# EAGLE design T06_LockBox (EAGLE 7.1.0)
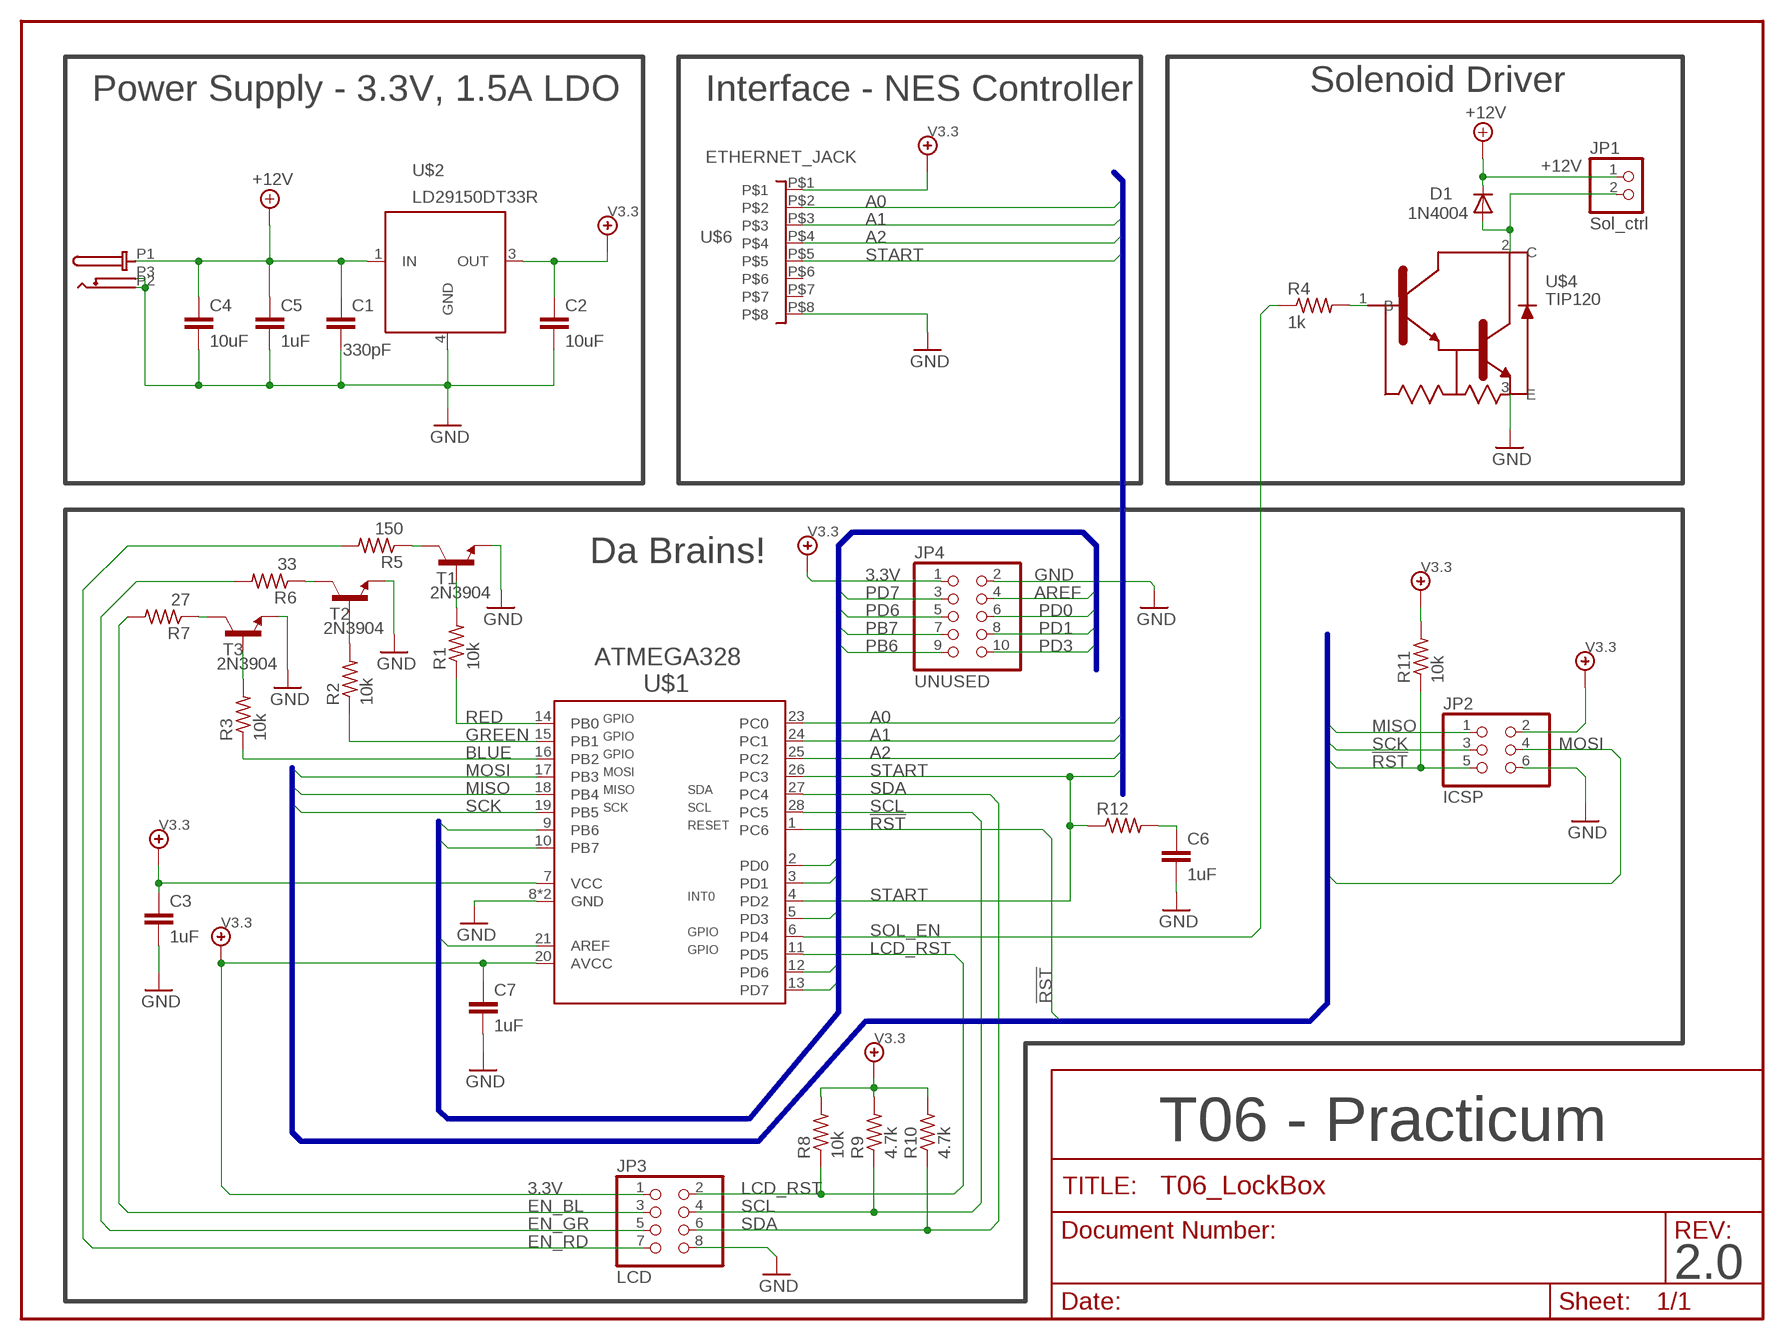
[diagram p0: schematic, sheet 1]

## Parts
C1  330pF  C  [C0805]
C2  10uF  C  [C0805]
C3  1uF  C  [C0805]
C4  10uF  CC1206  [C1206]
C5  1uF  C  [C0805]
C6  1uF  C  [C0805]
C7  1uF  C  [C0805]
D1  1N4004  [DO41-10]
JP1  Sol_ctrl  PINHD-1X2  [1X02]
JP2  ICSP  PINHD-2X3  [2X03]
JP3  LCD  PINHD-2X4  [2X04]
JP4  UNUSED  PINHD-2X5  [2X05]
R1  10k  R-US_R0805  [R0805]
R2  10k  R-US_R0805  [R0805]
R3  10k  R-US_R0805  [R0805]
R4  1k  R-US_M0805  [M0805]
R5  150  R-US_R0805  [R0805]
R6  33  R-US_R0805  [R0805]
R7  27  R-US_R0805  [R0805]
R8  10k  R-US_R0805  [R0805]
R9  4.7k  R-US_R0805  [R0805]
R10  4.7k  R-US_R0805  [R0805]
R11  10k  R-US_M0805  [M0805]
R12  R-US_M0805  [M0805]
T1  2N3904  [TO92-BCE]
T2  2N3904  [TO92-BCE]
T3  2N3904  [TO92-BCE]
U$1  ATMEGA328  [DIL28-3]
U$2  LD29150DT33R  [DPAK]
U$3  PJ-102A  [PJ-102A]
U$4  TIP120  [T0220-3]
U$6  ETHERNET_JACK  [MODJACK8]

## Nets
3.3V: C2.1 C3.1 C7.1 JP2.2 JP3.1 JP4.1 R8.2 R9.2 R10.2 R11.2 U$1.7(VCC) U$1.20(AVCC) U$2.3(OUT) U$6.P$1 ; supply symbol labelled V3.3
!RST: JP2.5 R11.1 U$1.1(PC6)
+12V: C1.1 C4.1 C5.1 D1.C JP1.1 U$2.1(IN) U$3.P1(PWR)
A0: U$1.23(PC0) U$6.P$2
A1: U$1.24(PC1) U$6.P$3
A2: U$1.25(PC2) U$6.P$4
AREF: JP4.4 U$1.21(AREF)
BLUE: R3.1 U$1.16(PB2)
EN_BL: JP3.3 R7.2
EN_GR: JP3.5 R6.2
EN_RD: JP3.7 R5.2
GND: C1.2 C2.2 C3.2 C4.2 C5.2 C6.2 C7.2 JP2.6 JP3.8 JP4.2 T1.E T2.E T3.E U$1.8(GND) U$1.22(GND) U$2.4(GND) U$3.P2(GND) U$3.P3(GND) U$4.3(E) U$6.P$8
GREEN: R2.1 U$1.15(PB1)
LCD_RST: JP3.2 R8.1 U$1.11(PD5)
MISO: JP2.1 U$1.18(PB4)
MOSI: JP2.4 U$1.17(PB3)
N$1: R4.2 U$4.1(B)
N$3: C6.1 R12.2
N$5: D1.A JP1.2 U$4.2(C)
N$6: R1.2 T1.B
N$7: R2.2 T2.B
N$8: R3.2 T3.B
N$10: R7.1 T3.C
N$11: R6.1 T2.C
N$12: R5.1 T1.C
PB6: JP4.9 U$1.9(PB6)
PB7: JP4.7 U$1.10(PB7)
PD0: JP4.6 U$1.2(PD0)
PD1: JP4.8 U$1.3(PD1)
PD3: JP4.10 U$1.5(PD3)
PD6: JP4.5 U$1.12(PD6)
PD7: JP4.3 U$1.13(PD7)
RED: R1.1 U$1.14(PB0)
SCK: JP2.3 U$1.19(PB5)
SCL: JP3.4 R9.1 U$1.28(PC5)
SDA: JP3.6 R10.1 U$1.27(PC4)
SOL_EN: R4.1 U$1.6(PD4)
START: R12.1 U$1.4(PD2) U$1.26(PC3) U$6.P$5
Unconnected: U$6.P$6 U$6.P$7

## Buses
NES_ENCODER_BUS:A0,A1,A2,START
ICSP_BUS:MISO,MOSI,!RST,SCK
UNUSED:AREF,PB6,PB7,PD0,PD1,PD3,PD6,PD7

## Notes on the sheet
- Power Supply - 3.3V, 1.5A LDO | Interface - NES Controller | Solenoid Driver
- Da Brains!
- T06 - Practicum
- 2.0

## Library data of the parts
C1-C7 = T06_Lockbox:C: CAPACITOR, European symbol; SPICEMODEL: NONE; SPICEPREFIX: C
D1 = T06_Lockbox:1N4004: DIODE general purpose rectifier, 1 A
JP1 = T06_Lockbox:PINHD-1X2: PIN HEADER
JP2 = T06_Lockbox:PINHD-2X3: PIN HEADER
JP3 = T06_Lockbox:PINHD-2X4: PIN HEADER
JP4 = T06_Lockbox:PINHD-2X5: PIN HEADER
R1-R12 = T06_Lockbox:R-US_: RESISTOR, American symbol
T1-T3 = T06_Lockbox:2N3904: NPN TRANSISTOR
U$1 = T06_Lockbox:ATMEGA328: Atmel 8-bit Microcontroller source: http://www.atmel.com/images/atmel-8271-8-bit-avr-microcontroller-atmega48a-48pa-88a-88pa-168a-168pa-328-328p_datasheet_summary.pdf; DIGIKEY: http://www.digikey.com/product-detail/en/ATMEGA328-PU/ATMEGA328-PU-ND/2271026; PB0: GPIO; PB1: GPIO; PB2: GPIO; PB3: MOSI; PB4: MISO; PB5: SCK; PC4: SDA; PC5: SCL; PC6: RESET; PD2: INT0; PD4: GPIO; PD5: GPIO
U$2 = T06_Lockbox:LD29150: LD29150 - 1.5A, Very low drop voltage regulator High current, high accuracey, low-dropout voltage regulator Source: http://www.st.com/web/en/resource/technical/document/datasheet/CD00003403.pdf; DIGIKEY: 497-3468-1-ND; VOUT: 3.3V
U$3 = T06_Lockbox:PJ-102A
U$4 = T06_Lockbox:TIP120: TIP120 - NPN Epitaxial Darlington Transistor Medium Power Linear Switch Source: https://www.fairchildsemi.com/datasheets/TI/TIP122.pdf; DIGIKEY: TIP120TUFS-ND; MFG: Fairchild
U$6 = T06_Lockbox:ETHERNET_JACK: 8-Pin eithernet jack

## Board
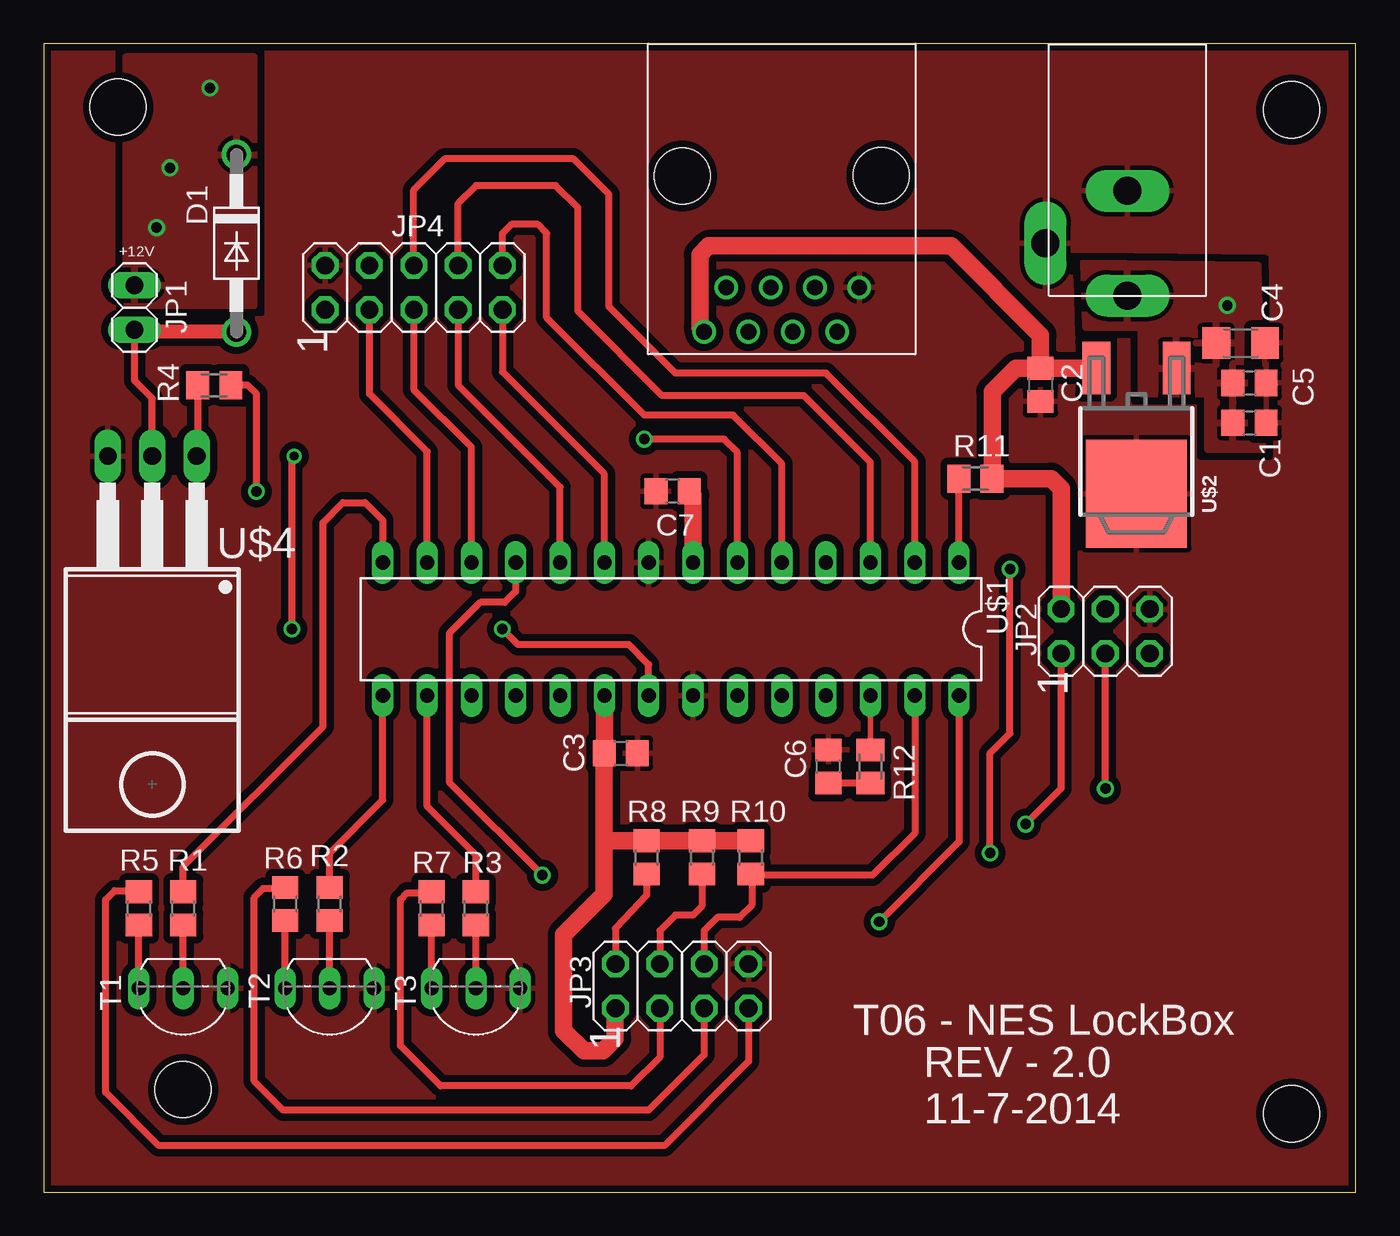
[diagram p1: board, top side]
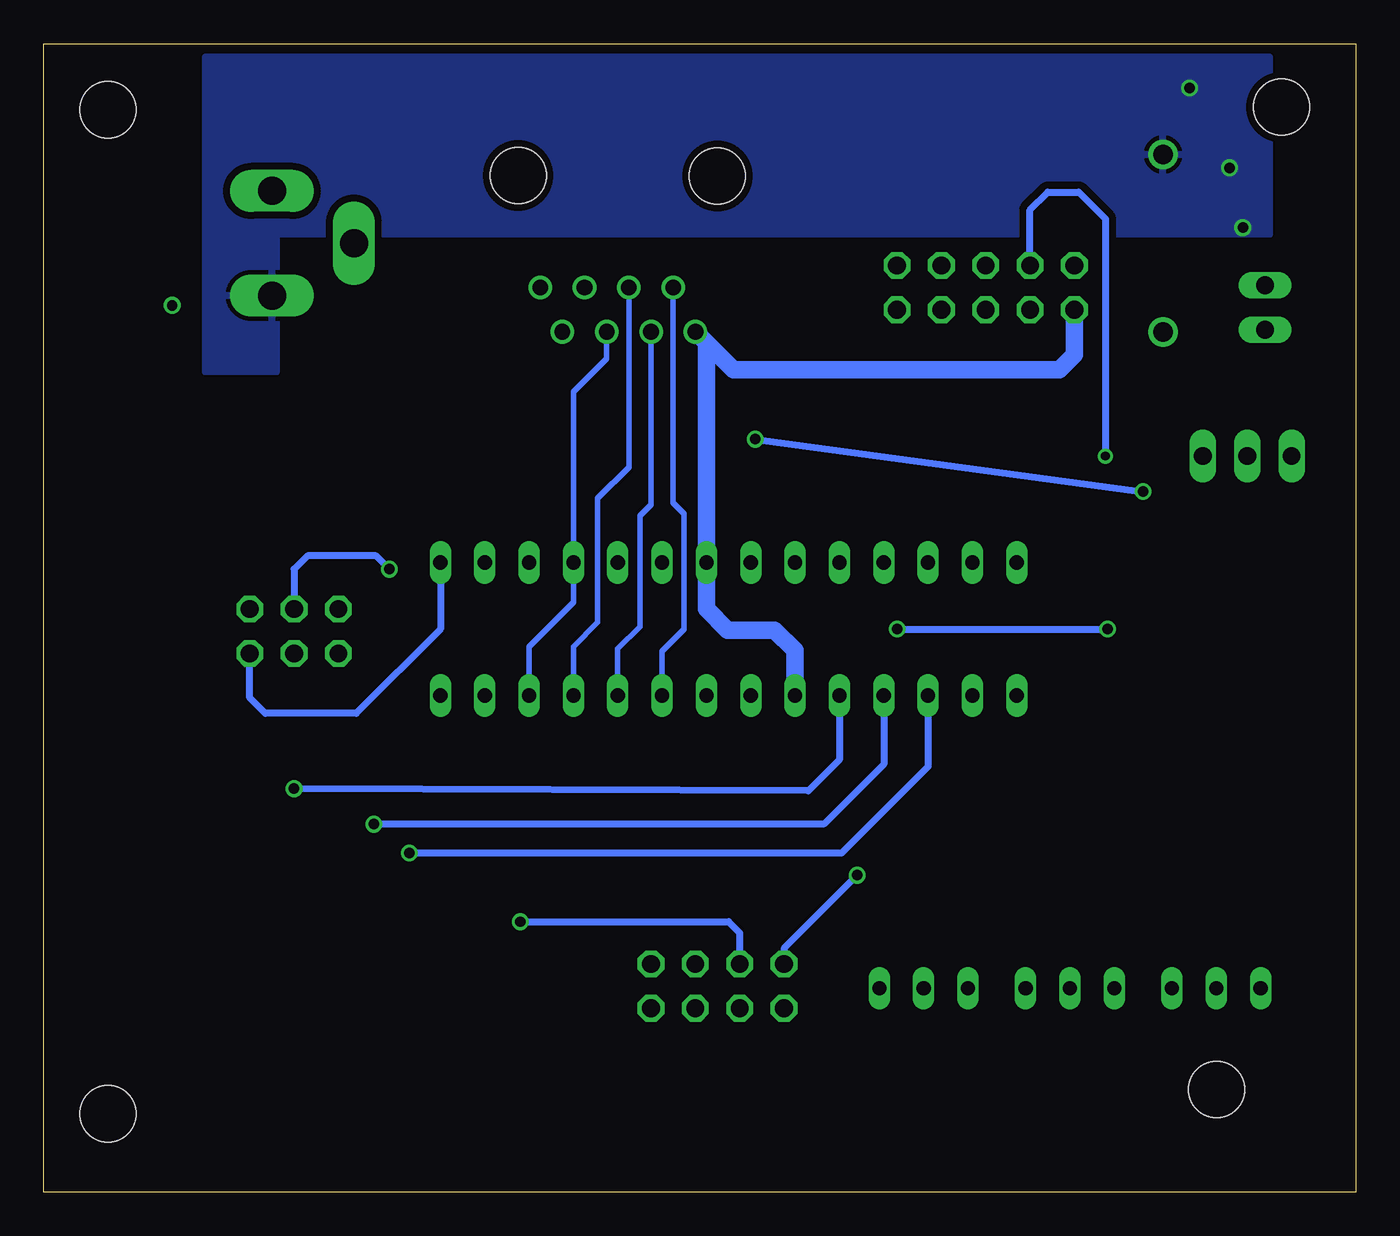
[diagram p2: board, bottom side, seen from below]

Size 75.18 x 65.79 mm. Coordinates in mm from the lower left corner, seen from the top.
Outline: 0,0 75.18,0 75.18,65.79 0,65.79 0,0
Copper layers (1*16): Top 0.0356mm / dielectric 1.5011mm / Bottom 0.0356mm
Design rules "oshpark-2layer": minimum track width 6mil, minimum drill 13mil, track to track 6mil, track to pad 6mil, pad to pad 6mil, via to via 6mil, smd to smd 6mil, copper to edge 15mil, drill to drill 6mil, minimum pad ring 7mil, minimum via ring 7mil, stop-mask expansion 4mil, vias tented up to drill 0mil, thermal gap 10mil
Holes 3.2 mm at 4.27,62.15 7.99,5.89 71.5,4.5 71.5,62

### Footprints (pad centres in the part's own frame; a part is rotated, then mirrored left to right if it is on the bottom)
C0805 = smd 1.3 x 1.5: 1 -0.95,0; 2 0.95,0
C1206 = smd 1.6 x 1.8: 1 -1.4,0; 2 1.4,0
DO41-10 = drill 1.118: A 5.08,0; C -5.08,0
1X02 = drill 1.016 long: 1 -1.27,0; 2 1.27,0
2X03 = drill 1.016 octagon: 1 -2.54,-1.27; 2 -2.54,1.27; 3 0,-1.27; 4 0,1.27; 5 2.54,-1.27; 6 2.54,1.27
2X04 = drill 1.016 octagon: 1 -3.81,-1.27; 2 -3.81,1.27; 3 -1.27,-1.27; 4 -1.27,1.27; 5 1.27,-1.27; 6 1.27,1.27; 7 3.81,-1.27; 8 3.81,1.27
2X05 = drill 1.016 octagon: 1 -5.08,-1.27; 2 -5.08,1.27; 3 -2.54,-1.27; 4 -2.54,1.27; 5 0,-1.27; 6 0,1.27; 7 2.54,-1.27; 8 2.54,1.27; 9 5.08,-1.27; 10 5.08,1.27
R0805 = smd 1.3 x 1.5: 1 -0.95,0; 2 0.95,0
M0805 = smd 1.3 x 1.6: 1 -0.95,0; 2 0.95,0
TO92-BCE = drill 0.813 long: B 0,0; C 2.54,0; E -2.54,0
DIL28-3 = drill 0.813 long: 1 -16.51,-3.81; 2 -13.97,-3.81; 3 -11.43,-3.81; 4 -8.89,-3.81; 5 -6.35,-3.81; 6 -3.81,-3.81; 7 -1.27,-3.81; 8 1.27,-3.81; 9 3.81,-3.81; 10 6.35,-3.81; 11 8.89,-3.81; 12 11.43,-3.81; 13 13.97,-3.81; 14 16.51,-3.81; 15 16.51,3.81; 16 13.97,3.81; 17 11.43,3.81; 18 8.89,3.81; 19 6.35,3.81; 20 3.81,3.81; 21 1.27,3.81; 22 -1.27,3.81; 23 -3.81,3.81; 24 -6.35,3.81; 25 -8.89,3.81; 26 -11.43,3.81; 27 -13.97,3.81; 28 -16.51,3.81
DPAK = smd 1.6 x 3: 1 -2.3,-7.2; 3 2.3,-7.2 | smd 5.8 x 6.2: 4 0,0
PJ-102A = drill 1.6 long: P1 0,-3; P2 0,3; P3 -4.7,0
T0220-3 = drill 1.016 long: 1 -2.54,-11.43; 2 0,-11.43; 3 2.54,-11.43
MODJACK8 = drill 0.9: P$1 4.45,16.5; P$2 3.18,13.96; P$3 1.91,16.5; P$4 0.64,13.96; P$5 -0.63,16.5; P$6 -1.9,13.96; P$7 -3.17,16.5; P$8 -4.44,13.96 | hole 3.2: 5.71,7.58; -5.7,7.55

### Placement (x,y rotation side)
C1  69.09,44.07 0 top
C2  57.11,46.24 270 top
C3  33.07,25.15 0 top
C4  68.58,48.64 0 top
C5  69.09,46.35 0 top
C6  44.96,24.38 90 top
C7  36.03,40.15 180 top
D1  11.05,54.36 270 top
JP1  5.21,50.67 270 top
JP2  60.83,32.13 0 top
JP3  36.58,11.81 0 top
JP4  21.21,51.82 0 top
R1  8,16.26 270 top
R2  16.38,16.51 270 top
R3  24.77,16.26 270 top
R4  9.78,46.23 180 top
R5  5.46,16.26 90 top
R6  13.84,16.51 90 top
R7  22.23,16.26 90 top
R8  34.54,19.18 90 top
R9  37.72,19.18 90 top
R10  40.51,19.18 90 top
R11  53.39,40.88 0 top
R12  47.37,24.38 270 top
T1  8,11.68 180 top
T2  16.38,11.68 180 top
T3  24.77,11.68 180 top
U$1  35.94,32.26 180 top
U$2  62.61,40.01 180 top
U$3  62.1,54.36 0 top
U$4  6.22,30.73 180 top
U$6  42.29,65.79 180 top

### Tracks (layer width: path | path; a pad name or v marks a point on that pad's centre or on a via)
3.3V
  Top 0.406: C7.1 37.21,40.15
  Top 1.016: U$2.3 57.13,47.2 C2.1 | C2.1 57.11,49.09 52,54.2 38.1,54.2 37.6,53.7 37.6,49.53 U$6.P$1 | C2.1 55.69,47.19 54.35,45.85 R11.2 57.72,40.88 58.3,40.3 JP2.2 | U$1.20 C3.1 32.12,20.1 | 32.12,20.1 32.12,17.07 29.8,14.75 29.8,9.25 30.95,8.1 32.05,8.1 32.75,8.8 32.75,10.53 JP3.1 | R10.2 R9.2 R8.2 32.15,20.13 32.12,20.1 | U$1.7 37.21,39.92 C7.1
  Bottom 1.016: JP4.1 16.13,47.97 17,47.1 35.66,47.1 37.21,48.66 | 37.21,48.66 U$6.P$1 | 37.21,48.66 U$1.7 37.21,33.41 36,32.2 33.3,32.2 32.15,31.05 32.15,28.47 U$1.20
!RST
  Top 0.406: U$1.1 52.45,40.86 R11.1
  Bottom 0.406: U$1.1 52.45,32.26 57.28,27.43 62.48,27.43 63.37,28.32 JP2.5
+12V  (via drill 0.6)
  other vias: 6.48,55.24 67.82,50.8 9.53,63.25 7.24,58.67
  pour Bottom (isolate 0.406): 65.91,46.99 65.91,65.02 4.95,65.02 4.95,54.86 61.85,54.86 61.85,46.99
  pour Top (isolate 0.406): 59.56,53.21 59.69,49.53 62.87,49.53 62.87,45.72 66.67,45.72 66.67,42.55 69.85,42.55 69.72,46.86 69.6,53.09
  pour Top (isolate 0.406): 4.7,65.02 4.7,50.8 12.06,50.8 12.06,65.02
A0
  Bottom 0.305: U$6.P$2 39.11,39.49 38.48,38.86 38.48,32.26 39.75,30.99 U$1.23
A1
  Bottom 0.305: U$6.P$3 40.38,39.38 41.02,38.73 41.02,32.38 42.29,31.11 U$1.24
A2
  Bottom 0.305: U$6.P$4 41.65,41.53 43.43,39.75 43.43,32.64 44.83,31.24 U$1.25
AREF  (via drill 0.5, 0.6)
  Top 0.406: U$1.21 34.67,30.23 33.53,31.37 27.18,31.37 v26.29,32.26 | v14.35,42.16 14.22,42.16 v14.22,32.26
  Bottom 0.406: v26.29,32.26 v14.22,32.26 | JP4.4 18.67,56.26 17.65,57.28 15.88,57.28 14.35,55.75 v14.35,42.16
BLUE
  Top 0.406: R3.1 24.77,19.3 21.97,22.1 U$1.16
EN_BL
  Top 0.406: JP3.3 35.31,7.75 33.66,6.1 22.73,6.1 20.45,8.38 20.45,16.76 20.83,17.14 22.16,17.14 R7.2
EN_GR
  Top 0.406: JP3.5 37.85,7.87 34.67,4.7 13.72,4.7 12.06,6.35 12.06,16.89 12.57,17.4 13.78,17.4 R6.2
EN_RD
  Top 0.406: JP3.7 40.39,7.49 35.56,2.67 6.6,2.67 3.56,5.71 3.56,16.76 4.06,17.27 5.39,17.27 R5.2
GND
  pour Top (isolate 0.406, rank 3): 0.13,66.29 0,0 75.18,0 75.31,66.29
GREEN
  Top 0.406: R2.1 16.38,19.43 19.43,22.48 U$1.15
LCD_RST  (via drill 0.6)
  Top 0.406: U$1.11 27.05,34.42 26.42,33.78 25.02,33.78 23.24,32 23.24,23.5 v28.57,18.16 | R8.1 34.54,17.02 32.77,15.11 JP3.2
  Bottom 0.406: v28.57,18.16 32.77,13.97 JP3.2
MISO  (via drill 0.6)
  Top 0.406: JP2.1 58.29,23.11 v56.26,21.08
  Bottom 0.406: U$1.18 27.05,24.51 30.48,21.08 v56.26,21.08
MOSI  (via drill 0.6)
  Top 0.406: v54.23,19.43 54.23,25.15 55.37,26.29 v55.37,35.69
  Bottom 0.406: U$1.17 24.51,24.38 29.46,19.43 v54.23,19.43 | v55.37,35.69 56.13,36.45 60.07,36.45 60.83,35.69 JP2.4
N$1
  Top 0.406: R4.2 8.83,42.23 U$4.1
N$3
  Top 0.406: R12.2 C6.1
N$5
  Top 0.406: U$4.2 6.22,45.47 5.21,46.48 JP1.2
  Top 0.813: D1.A 5.33,49.28 JP1.2
N$6
  Top 0.406: T1.B R1.2
N$7
  Top 0.406: T2.B R2.2
N$8
  Top 0.406: T3.B R3.2
N$10
  Top 0.406: T3.C R7.1
N$11
  Top 0.406: T2.C R6.1
N$12
  Top 0.406: T1.C R5.1
PB6
  Top 0.406: U$1.9 32.13,41.15 26.29,46.99 JP4.9
PB7
  Top 0.406: U$1.10 29.59,40.39 23.75,46.23 JP4.7
PD0
  Top 0.406: U$1.2 49.91,41.83 44.83,46.91 36.2,46.91 32.38,50.72 32.38,57.15 30.35,59.18 22.99,59.18 21.21,57.4 JP4.6
PD1
  Top 0.406: U$1.3 47.37,41.82 43.56,45.63 35.43,45.63 30.61,50.46 30.61,56.39 29.34,57.66 24.77,57.66 23.75,56.64 JP4.8
PD3
  Top 0.406: U$1.5 42.29,41.72 39.5,44.51 34.42,44.51 28.83,50.1 28.83,54.93 28.32,55.43 26.8,55.43 26.29,54.93 JP4.10
PD6
  Top 0.406: U$1.12 24.51,42.67 21.21,45.97 JP4.5
PD7
  Top 0.406: U$1.13 21.97,42.42 18.67,45.72 JP4.3
RED
  Top 0.406: R1.1 8,18.67 16,26.67 16,38.35 17.14,39.5 18.41,39.5 19.43,38.48 U$1.14
SCK  (via drill 0.6)
  Top 0.406: v60.83,23.11 JP2.3
  Bottom 0.406: U$1.19 29.59,24.77 31.37,22.99 v60.83,23.11
SCL  (via drill 0.6)
  Top 0.406: U$1.28 52.45,20.07 v47.88,15.49 | R9.1 37.72,16.38 37.21,15.88 36.2,15.88 35.31,14.99 JP3.4
  Bottom 0.406: v47.88,15.49 35.94,15.49 35.31,14.86 JP3.4
SDA
  Top 0.406: U$1.27 49.91,20.57 47.5,18.16 40.58,18.16 | 40.58,18.16 R10.1 | 40.58,18.16 40.58,16.45 39.88,15.75 38.61,15.75 37.85,14.99 JP3.6
SOL_EN  (via drill 0.6)
  Top 0.406: U$1.6 39.75,42.37 38.99,43.13 v34.42,43.13 | v12.19,40.13 12.19,45.72 11.68,46.23 R4.1
  Bottom 0.406: v34.42,43.13 v12.19,40.13
START
  Top 0.305: U$1.26 R12.1
  Top 0.406: 47.37,25.05 R12.1
  Bottom 0.305: U$6.P$5 42.93,47.75 44.83,45.85 U$1.4 44.83,33.78 47.37,31.24 U$1.26

### Text on the board
tPlace: +12V | 1 | 1 | T06 - NES LockBox | 1 | REV - 2.0 / 11-7-2014